# EAGLE design schematic (EAGLE 9.6.2)
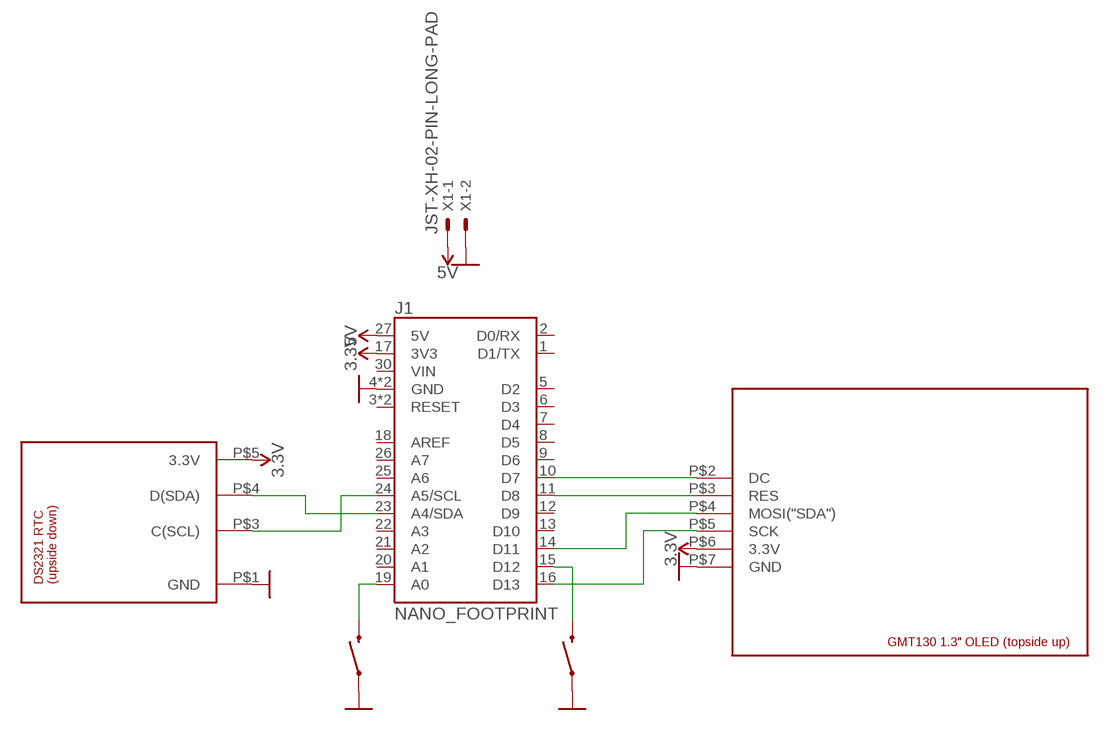
[diagram p0: schematic, sheet 1]

## Parts
J1  NANO_FOOTPRINT  [NANO]
S1  MOMENTARY-SWITCH-SPST-SMD-4.6X2.8MM  [TACTILE_SWITCH_SMD_4.6X2.8MM]
S2  MOMENTARY-SWITCH-SPST-SMD-4.6X2.8MM  [TACTILE_SWITCH_SMD_4.6X2.8MM]
U$1  GMT130-1.3-OLED  [GMT130-1.3-OLED]
U$2  DS2321-RTC  [DS2321-RTC]
X1  JST-XH-02-PIN-LONG-PAD  [JST-XH-02-PACKAGE-LONG-PAD]

## Nets
3.3V: J1.17(3V3) U$1.P$6(3.3V) U$2.P$5(3.3V)
5V: J1.27(5V) X1.1
GND: J1.4(GND) J1.29(GND) S1.1 S1.2 S2.1 S2.2 U$1.P$7(GND) U$2.P$1(GND) X1.2
N$1: J1.23(A4/SDA) U$2.P$4(D(SDA))
N$2: J1.24(A5/SCL) U$2.P$3(C(SCL))
N$3: J1.11(D8) U$1.P$3(RES)
N$4: J1.10(D7) U$1.P$2(DC)
N$5: J1.14(D11) U$1.P$4(MOSI("SDA"))
N$6: J1.16(D13) U$1.P$5(SCK)
N$7: J1.19(A0) S2.3 S2.4
N$8: J1.15(D12) S1.3 S1.4
Unconnected: J1.1(D1/TX) J1.2(D0/RX) J1.3(RESET) J1.5(D2) J1.6(D3) J1.7(D4) J1.8(D5) J1.9(D6) J1.12(D9) J1.13(D10) J1.18(AREF) J1.20(A1) J1.21(A2) J1.22(A3) J1.25(A6) J1.26(A7) J1.28(RESET) J1.30(VIN)

## Library data of the parts
J1 = SparkFun-Boards:NANO_FOOTPRINT: Generic Nano Footprint
S1 S2 = SparkFun-Switches:MOMENTARY-SWITCH-SPST: Momentary Switch (Pushbutton) - SPST Normally-open (NO) SPST momentary switches (buttons, pushbuttons). Variants PTH-12MM - 12mm square, through-hole Momentary Pushbutton Switch - 12mm Square <https://www.sparkfun.com/products/9190> (COM-09190) PTH-6.0MM, PTH-6.0MM-KIT - 6.0mm square, through-hole Mini Pushbutton Switch <https://www.sparkfun.com/products/97> (COM-00097) KIT package intended for soldering kit's - only one side of pads' copper is exposed. PTH-RIGHT-ANGLE-KIT - Right-angle, through-hole Right Angle Tactile Button <https://www.sparkfun.com/products/10791> - Used on SparkFun BigTime Watch Kit <https://www.sparkfun.com/products/11734> SMD-12MM - 12mm square, surface-mount Tactile Button - SMD (12mm) <https://www.sparkfun.com/products/12993> (COM-12993) Used on SparkFun PicoBoard <https://www.sparkfun.com/products/11888> SMD-4.5MM - 4.5mm Square Trackball Switch Used on SparkFun Blackberry Trackballer Breakout <https://www.sparkfun.com/products/13169> SMD-4.6MMX2.8MM - 4.60mm x 2.80mm, surface mount Used on SparkFun SAMD21 Mini Breakout <https://www.sparkfun.com/products/13664> SMD-5.2MM, SMD-5.2-REDUNDANT - 5.2mm square, surface-mount Mini Pushbutton Switch - SMD <https://www.sparkfun.com/products/8720> (COM-08720) Used on Arduino Pro Mini <https://www.sparkfun.com/products/11114> REDUNDANT package connects both switch circuits together SMD-6.0X3.5MM - 6.0 x 3.5mm, surface mount Momentary Reset Switch SMD <https://www.sparkfun.com/products/8229> (COM-08229) SMD-6.2MM-TALL - 6.2mm square, surface mount Tactile Button - SMD (6mm) <https://www.sparkfun.com/products/12992> Used on SparkFun Digital Sandbox <https://www.sparkfun.com/products/12651> SMD-RIGHT-ANGLE - Right-angle, surface mount Used on SparkFun Block for Intel® Edison - Arduino <https://www.sparkfun.com/products/13036>; PROD_ID: SWCH-13065
U$1 = Myke:GMT130-1.3-OLED
U$2 = Myke:DS2321-RTC
X1 = Rembrandt Electronics - JST XH Connectors v1-0:JST-XH-02-PIN: JST XH Connector 2 Pin Wire to board connector. Pitch: 2,54 mm, (0.100") Number of pins: 2 Created by Rembrandt Electronics www.rembrandtelectronics.com

## Board
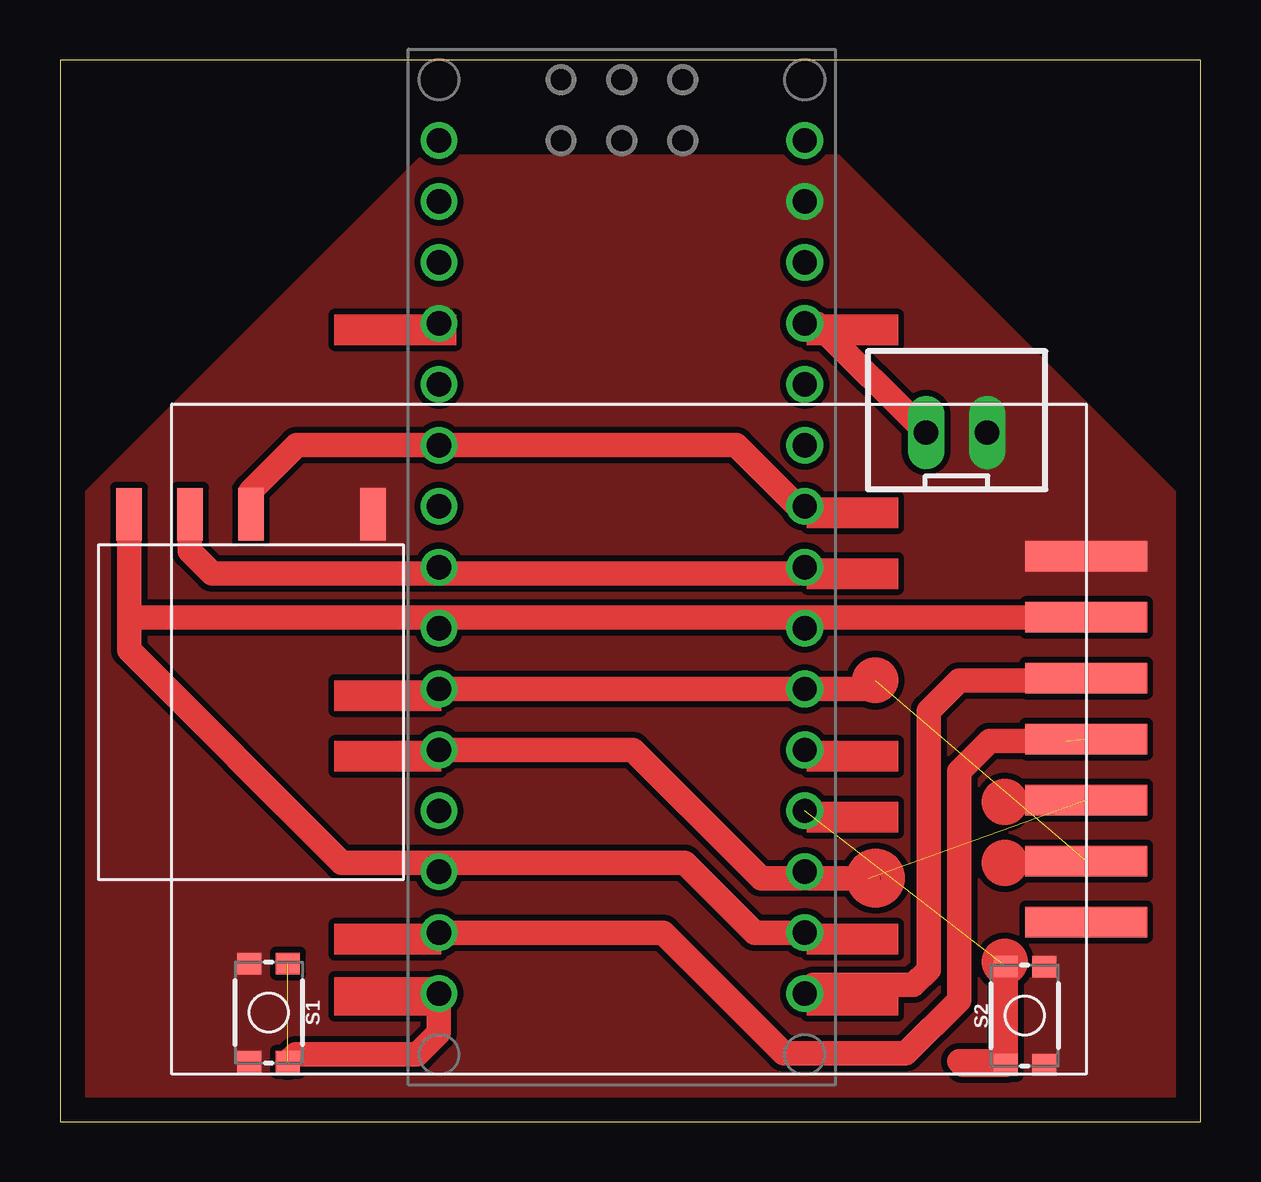
[diagram p1: board, top side]

Size 47.54 x 44.27 mm. Coordinates in mm from the lower left corner, seen from the top.
Outline: 0,0 47.54,0 47.54,44.27 0,44.27 0,0
Copper layers (1*16): Top 0.035mm / dielectric 1.5mm / Bottom 0.035mm
Design rules "default *": minimum track width 6mil, minimum drill 0.35mm, track to track 10mil, track to pad 10mil, pad to pad 10mil, via to via 10mil, smd to smd 6mil, copper to edge 40mil, drill to drill 6mil, minimum pad ring 10mil, minimum via ring 8mil, stop-mask expansion 4mil, vias tented up to drill 0mil, thermal gap 0mil

### Footprints (pad centres in the part's own frame; a part is rotated, then mirrored left to right if it is on the bottom)
NANO = drill 1.016: 1 -7.62,17.78; 2 -7.62,15.24; 3 -7.62,12.7; 4 -7.62,10.16; 5 -7.62,7.62; 6 -7.62,5.08; 7 -7.62,2.54; 8 -7.62,0; 9 -7.62,-2.54; 10 -7.62,-5.08; 11 -7.62,-7.62; 12 -7.62,-10.16; 13 -7.62,-12.7; 14 -7.62,-15.24; 15 -7.62,-17.78; 16 7.62,-17.78; 17 7.62,-15.24; 18 7.62,-12.7; 19 7.62,-10.16; 20 7.62,-7.62; 21 7.62,-5.08; 22 7.62,-2.54; 23 7.62,0; 24 7.62,2.54; 25 7.62,5.08; 26 7.62,7.62; 27 7.62,10.16; 28 7.62,12.7; 29 7.62,15.24; 30 7.62,17.78
TACTILE_SWITCH_SMD_4.6X2.8MM = smd 0.9 x 1: 1 -2.05,-0.8; 2 2.05,-0.8; 3 2.05,0.8; 4 -2.05,0.8
GMT130-1.3-OLED = smd 5.08 x 1.27: P$1 17.78,-5.08; P$2 17.78,-2.54; P$3 17.78,0; P$4 17.78,2.54; P$5 17.78,5.08; P$6 17.78,7.62; P$7 17.78,10.16
DS2321-RTC = smd 1.067 x 2.184: P$1 -5.08,-5.08; P$3 0,-5.08; P$4 2.54,-5.08; P$5 5.08,-5.08
JST-XH-02-PACKAGE-LONG-PAD = drill 1.016 long: 1 -1.27,0; 2 1.27,0

### Placement (x,y rotation side)
J1  23.41,23.13 0 top
S1  8.7,4.56 270 top
S2  40.2,4.44 90 top
U$1  24.98,13.42 0 top
U$2  7.96,20.26 180 top
X1  37.36,28.74 0 top

### Tracks (layer width: path | path; a pad name or v marks a point on that pad's centre or on a via)
3.3V
  Top 1.016: J1.17 28.94,7.89 26.04,10.79 11.75,10.79 2.88,19.67 2.88,21.27 | U$2.P$5 2.88,21.04 U$1.P$6
5V
  Top 1.016: J1.27 31.54,33.29 X1.1
GND
  pour Top: 0,0 0,25.18 15.09,40.27 32.45,40.27 47.54,25.18 47.54,0
N$1
  Top 1.016: U$2.P$4 5.41,23.79 6.35,22.86 30.76,22.86 J1.23
N$2
  Top 1.016: U$2.P$3 7.96,26.29 9.87,28.21 28.17,28.21 30.71,25.67 J1.24
N$3  (1 unrouted)
  Top 1.016: J1.11 23.86,15.51 29.21,10.16 33.66,10.16
N$4  (1 unrouted)
  Top 1.016: J1.10 33.61,18.05 33.97,18.41
N$5  (1 unrouted)
  Top 1.016: J1.14 25.13,7.89 30.16,2.86 35.24,2.86 37.47,5.08 37.47,14.61 38.74,15.88 41.91,15.88
N$6
  Top 1.016: J1.16 31.39,5.71 35.56,5.71 36.2,6.35 36.2,17.14 37.47,18.41 42.68,18.41 U$1.P$5
N$7  (1 unrouted)
  Top 1.016: S2.4 37.62,2.38 37.47,2.54 39.25,2.54 S2.4 | S2.4 S2.3
N$8  (1 unrouted)
  Top 1.016: J1.15 15.79,3.73 14.89,2.83 9.81,2.83 S1.3
(copper drawn outside any net)
  shapes: Top area x12, Top circle x5